# EAGLE schematic hoop (EAGLE 9.6.2)
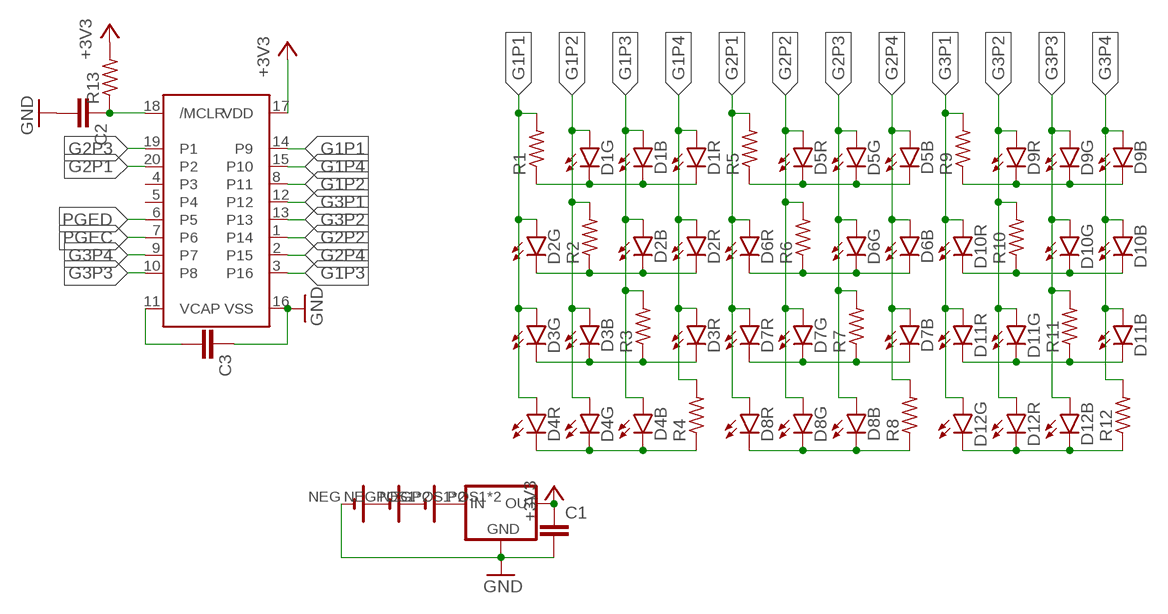
[diagram p0: schematic, sheet 1]

## Parts
B1  P312  [P312_CLIP]
B2  P312  [P312_CLIP]
B3  P312  [P312_CLIP]
C1  C-EUC0402  [C0402]
C2  C-EUC0402  [C0402]
C3  C-EUC0402  [C0402]
D1  FM-Z2727RGBA-SH  [SMD_2.8X2.7MM]
D2  FM-Z2727RGBA-SH  [SMD_2.8X2.7MM]
D3  FM-Z2727RGBA-SH  [SMD_2.8X2.7MM]
D4  FM-Z2727RGBA-SH  [SMD_2.8X2.7MM]
D5  FM-Z2727RGBA-SH  [SMD_2.8X2.7MM]
D6  FM-Z2727RGBA-SH  [SMD_2.8X2.7MM]
D7  FM-Z2727RGBA-SH  [SMD_2.8X2.7MM]
D8  FM-Z2727RGBA-SH  [SMD_2.8X2.7MM]
D9  FM-Z2727RGBA-SH  [SMD_2.8X2.7MM]
D10  FM-Z2727RGBA-SH  [SMD_2.8X2.7MM]
D11  FM-Z2727RGBA-SH  [SMD_2.8X2.7MM]
D12  FM-Z2727RGBA-SH  [SMD_2.8X2.7MM]
R1  R-US_R0805  [R0805]
R2  R-US_R0805  [R0805]
R3  R-US_R0805  [R0805]
R4  R-US_R0805  [R0805]
R5  R-US_R0805  [R0805]
R6  R-US_R0805  [R0805]
R7  R-US_R0805  [R0805]
R8  R-US_R0805  [R0805]
R9  R-US_R0805  [R0805]
R10  R-US_R0805  [R0805]
R11  R-US_R0805  [R0805]
R12  R-US_R0805  [R0805]
R13  R-US_R0402  [R0402]
U1  PIC32MM0064GPL020-I/ML  [QFN50P400X400X100-21T280N]
U2  SGM2200  [SOT23]

## Nets
+3V3: C1.1 R13.2 U1.17(VDD) U2.2(OUT)
/MCLR: C2.1 R13.1 U1.18(/MCLR)
G1P1: D2.G+(G:A) D3.G+(G:A) D4.R+(R:A) R1.2 U1.14(P9)
G1P2: D1.G+(G:A) D3.B+(B:A) D4.G+(G:A) R2.2 U1.8(P11)
G1P3: D1.B+(B:A) D2.B+(B:A) D4.B+(B:A) R3.2 U1.3(P16)
G1P4: D1.R+(R:A) D2.R+(R:A) D3.R+(R:A) R4.2 U1.15(P10)
G2P1: D6.R+(R:A) D7.R+(R:A) D8.R+(R:A) R5.2 U1.20(P2)
G2P2: D5.R+(R:A) D7.G+(G:A) D8.G+(G:A) R6.2 U1.1(P14)
G2P3: D5.G+(G:A) D6.G+(G:A) D8.B+(B:A) R7.2 U1.19(P1)
G2P4: D5.B+(B:A) D6.B+(B:A) D7.B+(B:A) R8.2 U1.2(P15)
G3P1: D10.R+(R:A) D11.R+(R:A) D12.G+(G:A) R9.2 U1.12
G3P2: D9.R+(R:A) D11.G+(G:A) D12.R+(R:A) R10.2 U1.13
G3P3: D9.G+(G:A) D10.G+(G:A) D12.B+(B:A) R11.2 U1.10(P8)
G3P4: D9.B+(B:A) D10.B+(B:A) D11.B+(B:A) R12.2 U1.9(P7)
GND: B1.NEG(-) C1.2 C2.2 C3.1 U1.16(VSS) U2.1(GND)
N$1: D1.B-(B:C) D1.G-(G:C) D1.R-(R:C) R1.1
N$2: C3.2 U1.11(VCAP)
N$3: D2.B-(B:C) D2.G-(G:C) D2.R-(R:C) R2.1
N$4: D4.B-(B:C) D4.G-(G:C) D4.R-(R:C) R4.1
N$6: D3.B-(B:C) D3.G-(G:C) D3.R-(R:C) R3.1
N$7: D12.B-(B:C) D12.G-(G:C) D12.R-(R:C) R12.1
N$9: D5.B-(B:C) D5.G-(G:C) D5.R-(R:C) R5.1
N$10: D6.B-(B:C) D6.G-(G:C) D6.R-(R:C) R6.1
N$11: D7.B-(B:C) D7.G-(G:C) D7.R-(R:C) R7.1
N$12: D8.B-(B:C) D8.G-(G:C) D8.R-(R:C) R8.1
N$17: D9.B-(B:C) D9.G-(G:C) D9.R-(R:C) R9.1
N$18: D10.B-(B:C) D10.G-(G:C) D10.R-(R:C) R10.1
N$19: D11.B-(B:C) D11.G-(G:C) D11.R-(R:C) R11.1
N$25: B1.POS1(+) B1.POS2(+) B2.NEG(-)
N$26: B2.POS1(+) B2.POS2(+) B3.NEG(-)
N$27: B3.POS1(+) B3.POS2(+) U2.3(IN)
PGEC: U1.7(P6)
PGED: U1.6(P5)
Unconnected: U1.4(P3) U1.5(P4)

## Library data of the parts
B1-B3 = earring:P312
C1-C3 = rcl:C-EU: CAPACITOR, European symbol; SPICEPREFIX: C
D1-D12 = earring:FM-Z2727RGBA-SH
R1-R13 = rcl:R-US_: RESISTOR, American symbol; SPICEPREFIX: R
U1 = earring:PIC32MM0064GPL020-I/ML
U2 = earring:SGM2200